# EAGLE design tick-mk-4.3 (EAGLE 6.5.0)
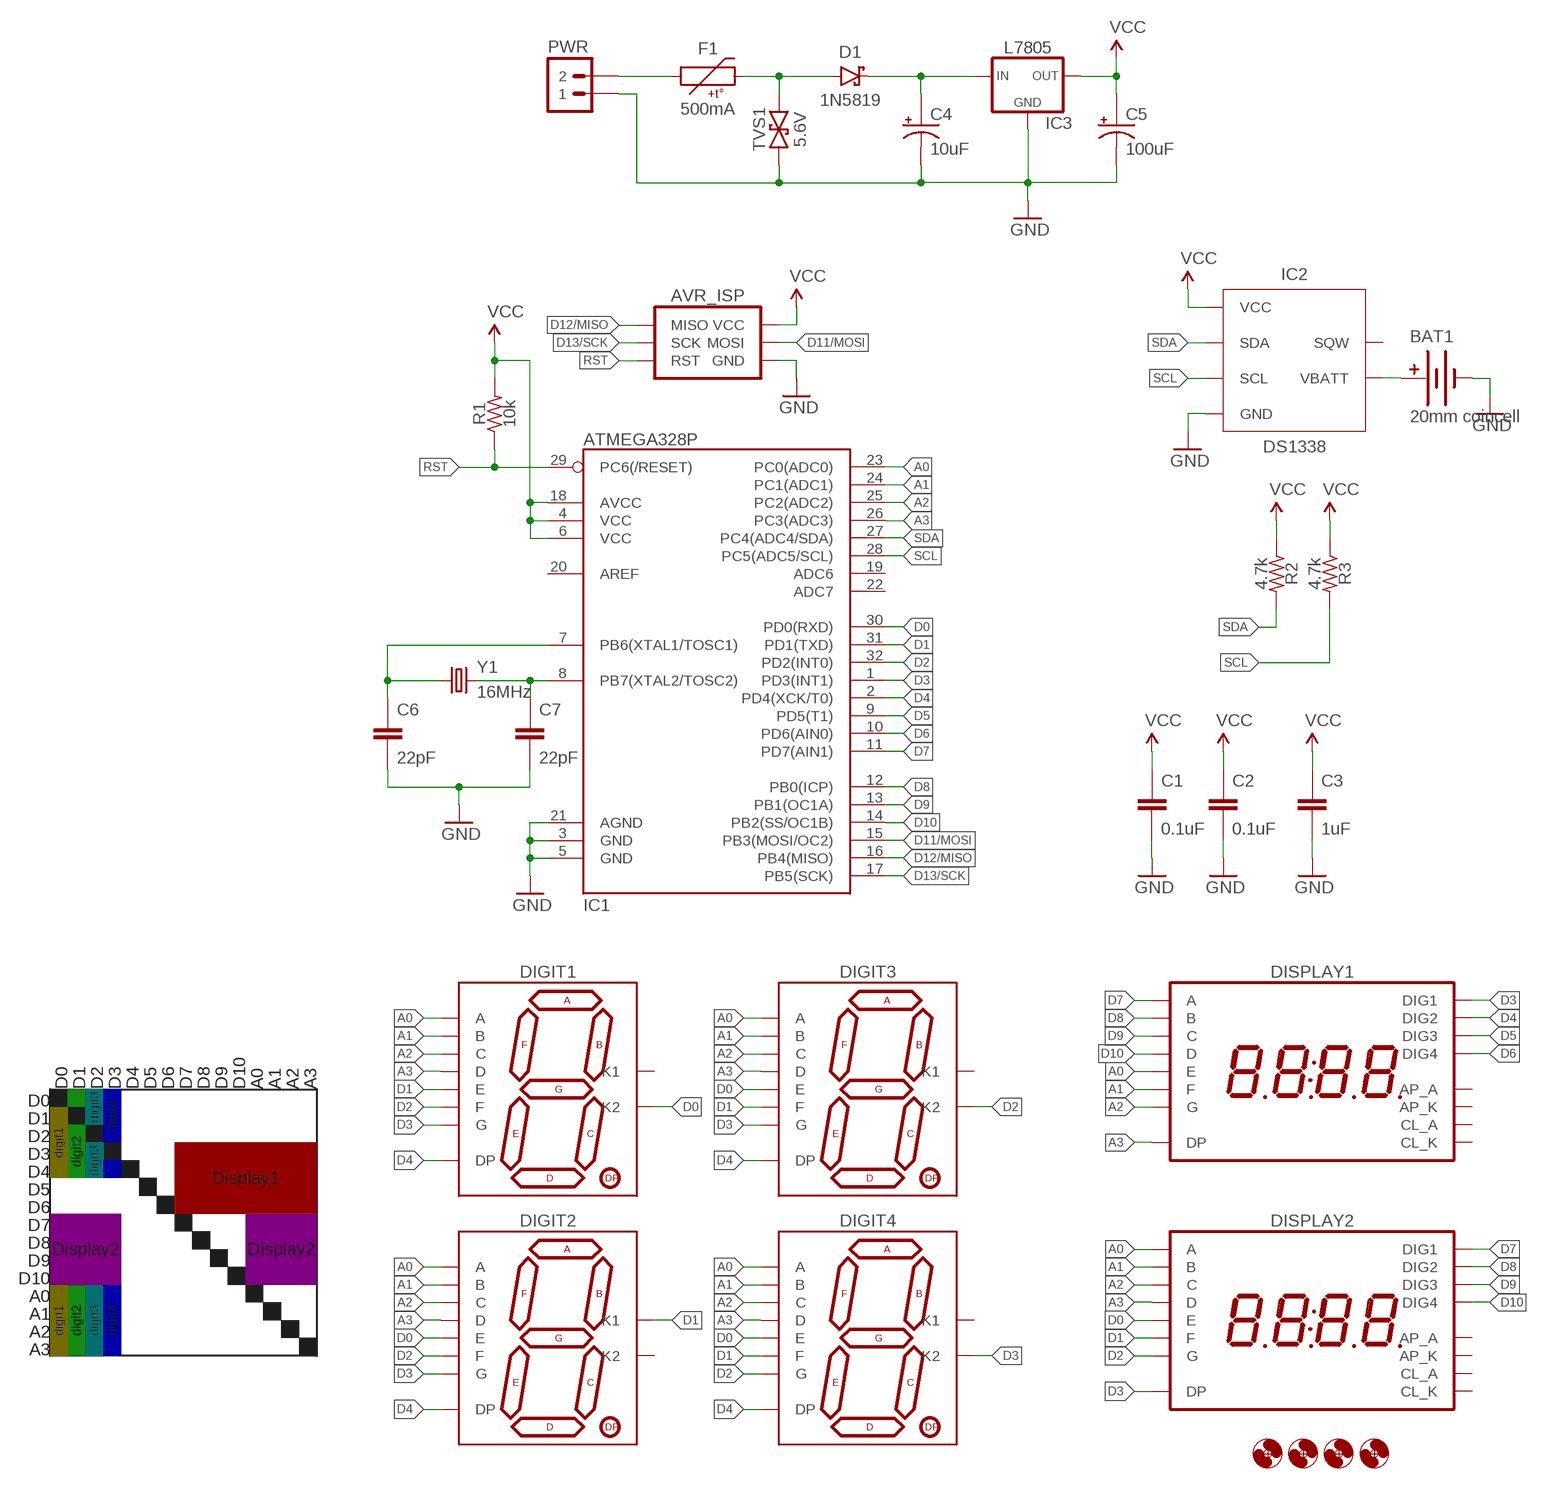
[diagram p0: schematic, sheet 1]

## Parts
AVR_ISP  AVR_SPI_PRG_6PTH  [2X3]
BAT1  20mm coincell  BATTERY20MMSMD-MINE  [BATTCON_20MM_MINE]
C1  0.1uF  CAPACITOR-CERAMIC025-024X044  [C025-024X044]
C2  0.1uF  CAPACITOR-CERAMIC025-024X044  [C025-024X044]
C3  1uF  CAPACITOR-CERAMIC025-024X044  [C025-024X044]
C4  10uF  CAPACITOR-POLARIZEDE2-5  [E2-5]
C5  100uF  CAPACITOR-POLARIZEDE2.5-6  [E2,5-6]
C6  22pF  CAPACITOR-CERAMIC025-024X044  [C025-024X044]
C7  22pF  CAPACITOR-CERAMIC025-024X044  [C025-024X044]
D1  1N5819  DIODE-SCHOTTKYPTH-10.16MM  [DIODE-10.16MM]
DIGIT1  7SEG_1DIGPTH-25.4MM-BARE  [7SEG_1DIG_25.4MM_NOSILK]
DIGIT2  7SEG_1DIGPTH-25.4MM-BARE  [7SEG_1DIG_25.4MM_NOSILK]
DIGIT3  7SEG_1DIGPTH-25.4MM-BARE  [7SEG_1DIG_25.4MM_NOSILK]
DIGIT4  7SEG_1DIGPTH-25.4MM-BARE  [7SEG_1DIG_25.4MM_NOSILK]
DISPLAY1  7SEG_4DIGIT_COLON_APOS  [7SEG_4DIG_10MM]
DISPLAY2  7SEG_4DIGIT_COLON_APOS  [7SEG_4DIG_10MM]
F1  500mA  PTCPTH-5.08MM  [PTC-PTH-5.08MM]
H1  HOLE#2  [HOLE-#2]
H2  HOLE#2  [HOLE-#2]
H3  HOLE#2  [HOLE-#2]
H4  HOLE#2  [HOLE-#2]
IC1  ATMEGA328P  ATMEGA328_SMT  [TQFP32-08]
IC2  DS1338  DS1338CSOIC16W  [SO16W]
IC3  L7805  V_REG_78XXTO-220-THERMPAD  [TO220-IGO-THERMPAD]
PWR  M02JST-PTH-VERT  [JST-2-PH-VERT-PTH]
R1  10k  RESISTORPTH-AXIAL-6.35MM  [RESISTOR-AXIAL-PTH-6.35MM]
R2  4.7k  RESISTORPTH-AXIAL-6.35MM  [RESISTOR-AXIAL-PTH-6.35MM]
R3  4.7k  RESISTORPTH-AXIAL-6.35MM  [RESISTOR-AXIAL-PTH-6.35MM]
TVS1  5.6V  TVSDO-41-10.16MM  [DO-41-TVS-BI-10.16MM]
Y1  16MHz  CRYSTALHC49UV  [HC49U-V]

## Nets
A0: DIGIT1.7(A) DIGIT2.7(A) DIGIT3.7(A) DIGIT4.7(A) DISPLAY1.5(E) DISPLAY2.14(A) IC1.23(PC0(ADC0))
A1: DIGIT1.6(B) DIGIT2.6(B) DIGIT3.6(B) DIGIT4.6(B) DISPLAY1.11(F) DISPLAY2.16(B) IC1.24(PC1(ADC1))
A2: DIGIT1.4(C) DIGIT2.4(C) DIGIT3.4(C) DIGIT4.4(C) DISPLAY1.15(G) DISPLAY2.13(C) IC1.25(PC2(ADC2))
A3: DIGIT1.2(D) DIGIT2.2(D) DIGIT3.2(D) DIGIT4.2(D) DISPLAY1.7(DP) DISPLAY2.3(D) IC1.26(PC3(ADC3))
D0: DIGIT1.8(K2) DIGIT2.1(E) DIGIT3.1(E) DIGIT4.1(E) DISPLAY2.5(E) IC1.30(PD0(RXD))
D1: DIGIT1.1(E) DIGIT2.3(K1) DIGIT3.9(F) DIGIT4.9(F) DISPLAY2.11(F) IC1.31(PD1(TXD))
D2: DIGIT1.9(F) DIGIT2.9(F) DIGIT3.8(K2) DIGIT4.10(G) DISPLAY2.15(G) IC1.32(PD2(INT0))
D3: DIGIT1.10(G) DIGIT2.10(G) DIGIT3.10(G) DIGIT4.8(K2) DISPLAY1.1(DIG1) DISPLAY2.7(DP) IC1.1(PD3(INT1))
D4: DIGIT1.5(DP) DIGIT2.5(DP) DIGIT3.5(DP) DIGIT4.5(DP) DISPLAY1.2(DIG2) IC1.2(PD4(XCK/T0))
D5: DISPLAY1.6(DIG3) IC1.9(PD5(T1))
D6: DISPLAY1.8(DIG4) IC1.10(PD6(AIN0))
D7: DISPLAY1.14(A) DISPLAY2.1(DIG1) IC1.11(PD7(AIN1))
D8: DISPLAY1.16(B) DISPLAY2.2(DIG2) IC1.12(PB0(ICP))
D9: DISPLAY1.13(C) DISPLAY2.6(DIG3) IC1.13(PB1(OC1A))
D10: DISPLAY1.3(D) DISPLAY2.8(DIG4) IC1.14(PB2(SS/OC1B))
D11/MOSI: AVR_ISP.4(MOSI) IC1.15(PB3(MOSI/OC2))
D12/MISO: AVR_ISP.1(MISO) IC1.16(PB4(MISO))
D13/SCK: AVR_ISP.3(SCK) IC1.17(PB5(SCK))
GND: AVR_ISP.6(GND) BAT1.BOTTOM(-) C1.2 C2.2 C3.2 C4.- C5.- C6.2 C7.2 IC1.3(GND) IC1.5(GND) IC1.21(AGND) IC2.4(GND) IC2.5(GND) IC2.6(GND) IC2.7(GND) IC2.8(GND) IC2.9(GND) IC2.10(GND) IC2.11(GND) IC2.12(GND) IC2.13(GND) IC2.15(GND) IC3.4(GND) IC3.GND PWR.1 TVS1.P$1
N$1: BAT1.TOP@1(+) BAT1.TOP@2(+) IC2.14(VBATT)
N$4: D1.A F1.P$2 TVS1.P$2
N$6: C6.1 IC1.7(PB6(XTAL1/TOSC1)) Y1.1
N$7: F1.P$1 PWR.2
N$8: C4.+ D1.C IC3.IN
N$9: C7.1 IC1.8(PB7(XTAL2/TOSC2)) Y1.2
RST: AVR_ISP.5(RST) IC1.29(PC6(/RESET)) R1.P$1
SCL: IC1.28(PC5(ADC5/SCL)) IC2.1(SCL) R3.P$2
SDA: IC1.27(PC4(ADC4/SDA)) IC2.16(SDA) R2.P$2
VCC: AVR_ISP.2(VCC) C1.1 C2.1 C3.1 C5.+ IC1.4(VCC) IC1.6(VCC) IC1.18(AVCC) IC2.3(VCC) IC3.OUT R1.P$2 R2.P$1 R3.P$1
Unconnected: DIGIT1.3(K1) DIGIT2.8(K2) DIGIT3.3(K1) DIGIT4.3(K1) DISPLAY1.4(CL_A) DISPLAY1.9(AP_K) DISPLAY1.10(AP_A) DISPLAY1.12(CL_K) DISPLAY2.4(CL_A) DISPLAY2.9(AP_K) DISPLAY2.10(AP_A) DISPLAY2.12(CL_K) IC1.19(ADC6) IC1.20(AREF) IC1.22(ADC7) IC2.2(SQW)

## Notes on the sheet
- D0 | D1 | D2 | D3 | D4 | D5 | D6 | D7 | D8 | D9 | D10 | A0 | A1 | A2 | A3
- D0 | digit3
- digit4
- D1
- D2 | digit1
- digit2
- D3 | digit3
- D4 | Display1
- D5
- D6
- D7
- D8 | Display2 | Display2
- D9
- D10
- A0
- A1 | digit1 | digit2 | digit3 | digit4
- A2
- A3

## Library data of the parts
AVR_ISP = A_butts:AVR_SPI_PRG_6: AVR ISP 6 Pin This is the reduced ISP connector for AVR programming. Common on Arduino. This footprint will take up less PCB space and can be used with a 10-pin to 6-pin adapter such as SKU: BOB-08508 **Special note about "TEST_POINT" package. The stop mask is on the top side, so if you want your programming test points to be on the bottom of your board, make sure to place this package on the bottom side of the board. This also ensure that the orientation to program from the bottom side will be correct.
BAT1 = A_butts:BATTERY: Battery Holders Various common sizes : AA, AAA, 20mm coin cell and 12mm coin cell. 20MM_4LEGS, BATT-10373
C1-C3 C6 C7 = A_butts:CAPACITOR-CERAMIC: CAPACITOR, European symbol
C4 C5 = A_butts:CAPACITOR-POLARIZED: POLARIZED CAPACITOR, American symbol
D1 = A_butts:DIODE-SCHOTTKY: Schottky diodes in SFE's production catalog BAT20J 1A 23V 0.62Vf RB751 120mA 40V 0.37Vf PMEG4005EJ 0.5A 40V 0.42Vf MBRA140 1A 40V 0.5Vf B340A 3A 40V SMA
DIGIT1-DIGIT4 = A_butts:7SEG_1DIG
DISPLAY1 DISPLAY2 = A_butts:7SEG_4DIGIT_COLON_APOS
F1 = A_butts:PTC: Resettable Fuse PTC Resettable Fuse. Spark Fun Electronics SKU : COM-08357
H1-H4 = A_butts:HOLE: MOUNTING HOLE with drill center marker
IC1 = A_butts:ATMEGA328_SMT: 32-Pin Atmega328 part Commonly used on Arduino compatible boards Available in QFP and QFN packages TQFP is IC-09069 QFN is non-stock; PROD_ID: IC-09069
IC2 = A_butts:DS1338C
IC3 = A_butts:V_REG_78XX: Voltage Regulator Standard 7805 5V regulator. IGO (Input Ground Output). Spark Fun Electronics SKU : COM-00107
PWR = A_butts:M02: Standard 2-pin 0.1" header. Use with - straight break away headers ( PRT-00116) - right angle break away headers (PRT-00553) - swiss pins (PRT-00743) - machine pins (PRT-00117) - female headers (PRT-00115) Molex polarized connector foot print use with: PRT-08233 with associated crimp pins and housings. 2.54_SCREWTERM for use with PRT-10571. 3.5mm Screw Terminal footprints for PRT-08084 5mm Screw Terminal footprints for use with PRT-08433
R1-R3 = A_butts:RESISTOR: RESISTOR, American symbol
TVS1 = A_butts:TVS: Transient voltage suppressor- prevents ESD on inputs. Ignore package description- MBRA140 is NOT this type of part!!!
Y1 = A_butts:CRYSTAL: Various standard crystals. Proven footprints. Spark Fun Electronics SKU : COM-00534

## Board
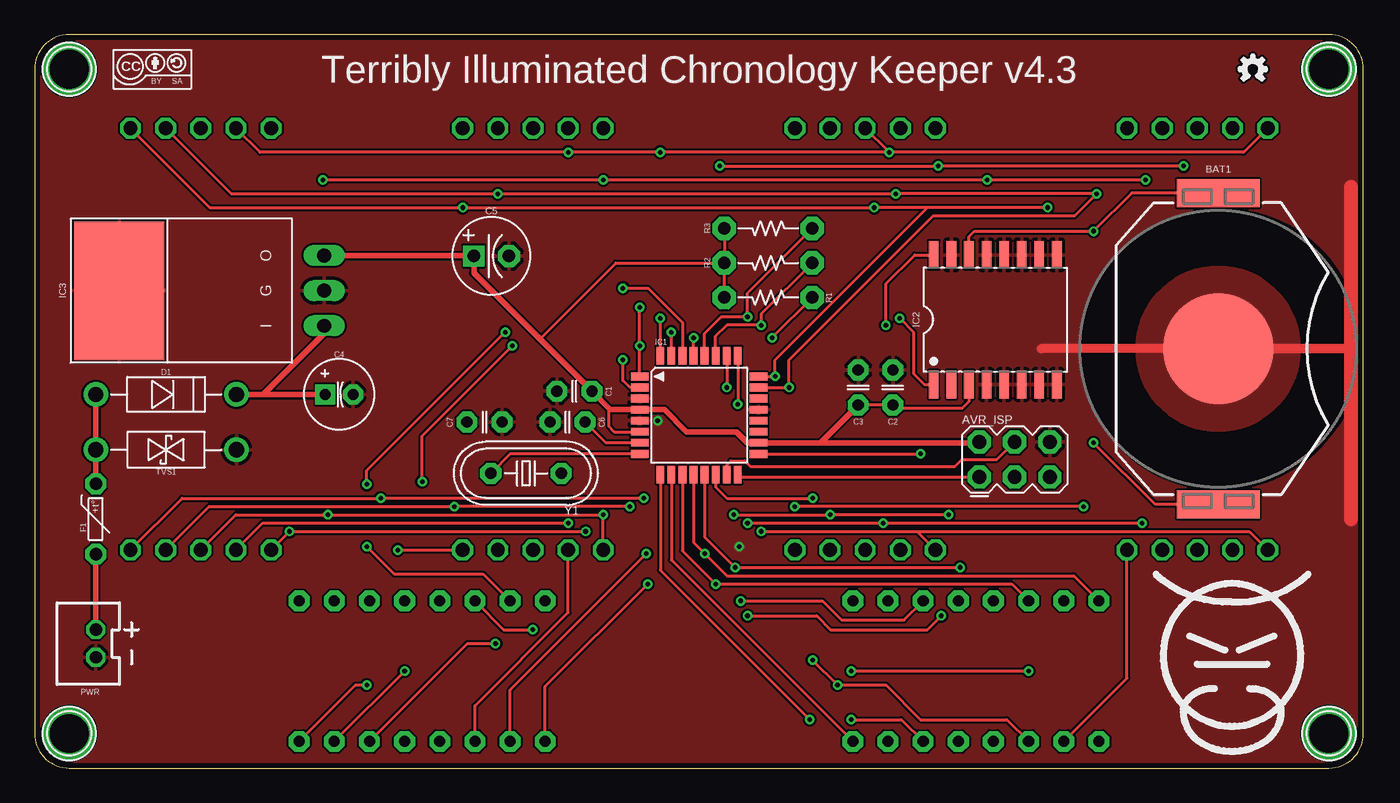
[diagram p1: board, top side]
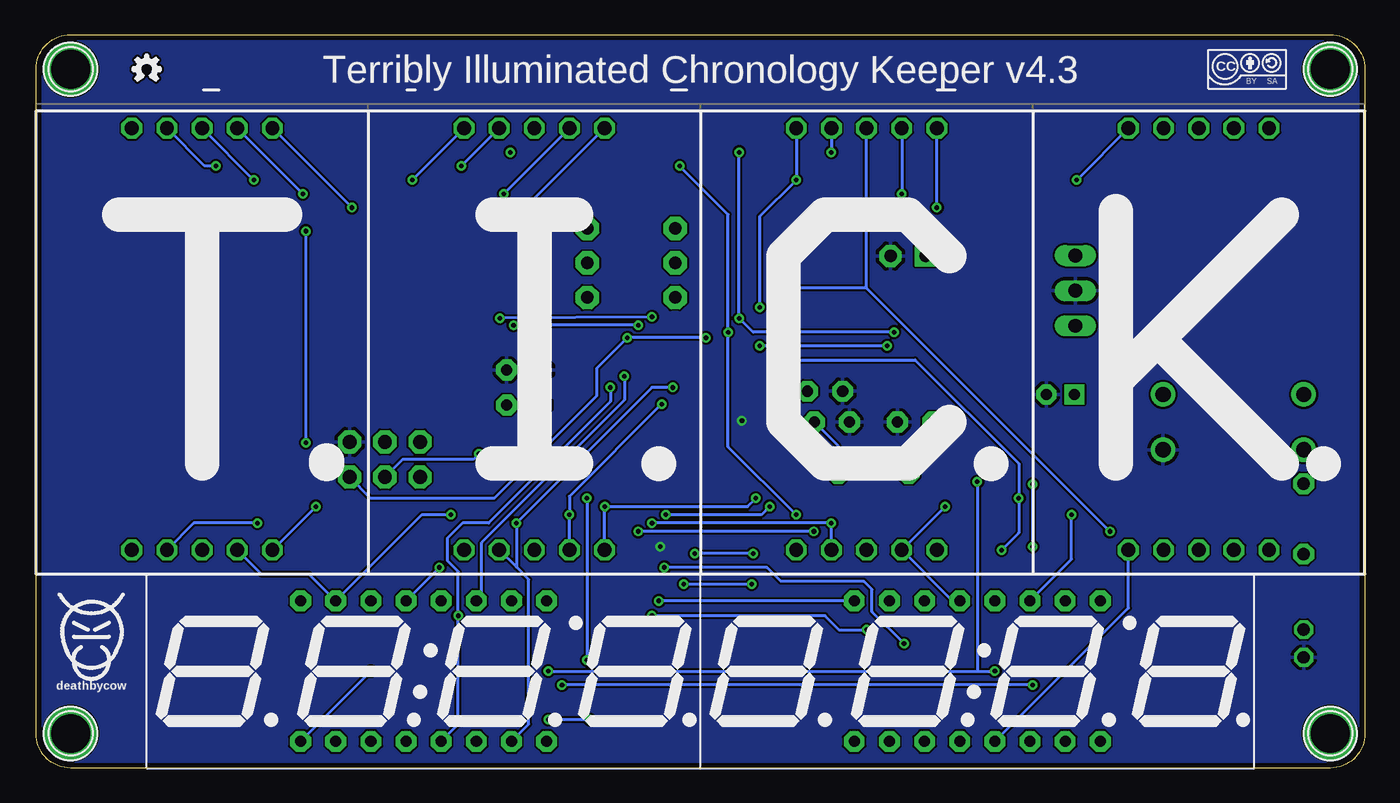
[diagram p2: board, bottom side, seen from below]

Size 96 x 53 mm. Coordinates in mm from the lower left corner, seen from the top.
Outline: 2.5,0 93.5,0 arc90 96,2.5 96,50.5 arc90 93.5,53 2.5,53 arc90 0,50.5 0,2.5 arc90 2.5,0
Copper layers (1*16): Top 0.0356mm / dielectric 1.5011mm / Bottom 0.0356mm
Design rules "LaenPCBOrder2": minimum track width 6mil, minimum drill 13mil, track to track 6mil, track to pad 6mil, pad to pad 6mil, via to via 6mil, smd to smd 6mil, copper to edge 15mil, drill to drill 6mil, minimum pad ring 7mil, minimum via ring 7mil, stop-mask expansion 3mil, vias tented up to drill 20mil, thermal gap 10mil

### Footprints (pad centres in the part's own frame; a part is rotated, then mirrored left to right if it is on the bottom)
2X3 = drill 1 pad 1.676 octagon: 1 -2.54,-1.27; 2 -2.54,1.27; 3 0,-1.27; 4 0,1.27; 5 2.54,-1.27; 6 2.54,1.27
BATTCON_20MM_MINE = smd 8 x 8: BOTTOM 0,0 | smd 6 x 2: TOP@1 0,11.25; TOP@2 0,-11.25
C025-024X044 = drill 0.813 pad 1.5 octagon: 1 -1.27,0; 2 1.27,0
E2-5 = drill 0.813 pad 1.422 square: + -1.016,0 | drill 0.813 pad 1.422 octagon: - 1.016,0
E2,5-6 = drill 0.9 pad 1.524 square: + -1.27,0 | drill 0.9 pad 1.6 octagon: - 1.27,0
DIODE-10.16MM = drill 1.1 pad 1.778: A -5.08,0; C 5.08,0
7SEG_1DIG_25.4MM_NOSILK = drill 1 pad 1.5 octagon: 1 -5.08,-15.24; 2 -2.54,-15.24; 3 0,-15.24; 4 2.54,-15.24; 5 5.08,-15.24; 6 5.08,15.24; 7 2.54,15.24; 8 0,15.24; 9 -2.54,15.24; 10 -5.08,15.24
7SEG_4DIG_10MM = drill 0.8 pad 1.5 octagon: 1 -8.89,-5.08; 2 -6.35,-5.08; 3 -3.81,-5.08; 4 -1.27,-5.08; 5 1.27,-5.08; 6 3.81,-5.08; 7 6.35,-5.08; 8 8.89,-5.08; 9 8.89,5.08; 10 6.35,5.08; 11 3.81,5.08; 12 1.27,5.08; 13 -1.27,5.08; 14 -3.81,5.08; 15 -6.35,5.08; 16 -8.89,5.08
PTC-PTH-5.08MM = drill 0.9 pad 1.5 octagon: P$1 -2.54,0; P$2 2.54,0
HOLE-#2 = drill 2.8 pad 3.81: P$1 0,0
TQFP32-08 = smd 1.27 x 0.559: 1 -4.293,2.8; 2 -4.293,2; 3 -4.293,1.2; 4 -4.293,0.4; 5 -4.293,-0.4; 6 -4.293,-1.2; 7 -4.293,-2; 8 -4.293,-2.8; 17 4.293,-2.8; 18 4.293,-2; 19 4.293,-1.2; 20 4.293,-0.4; 21 4.293,0.4; 22 4.293,1.2; 23 4.293,2; 24 4.293,2.8 | smd 0.559 x 1.27: 9 -2.8,-4.293; 10 -2,-4.293; 11 -1.2,-4.293; 12 -0.4,-4.293; 13 0.4,-4.293; 14 1.2,-4.293; 15 2,-4.293; 16 2.8,-4.293; 25 2.8,4.293; 26 2,4.293; 27 1.2,4.293; 28 0.4,4.293; 29 -0.4,4.293; 30 -1.2,4.293; 31 -2,4.293; 32 -2.8,4.293
SO16W = smd 0.7 x 2: 1 -4.445,-4.685; 2 -3.175,-4.685; 3 -1.905,-4.685; 4 -0.635,-4.685; 5 0.635,-4.685; 6 1.905,-4.685; 7 3.175,-4.685; 8 4.445,-4.685; 9 4.445,4.685; 10 3.175,4.685; 11 1.905,4.685; 12 0.635,4.685; 13 -0.635,4.685; 14 -1.905,4.685; 15 -3.175,4.685; 16 -4.445,4.685
TO220-IGO-THERMPAD = smd 10 x 6.5: 4 0,11 | drill 1 long: GND 0,-3.81; IN -2.54,-3.81; OUT 2.54,-3.81
JST-2-PH-VERT-PTH = drill 0.9 octagon: 1 -1,0; 2 1,0
RESISTOR-AXIAL-PTH-6.35MM = drill 0.9 pad 1.676 octagon: P$1 -3.175,0; P$2 3.175,0
DO-41-TVS-BI-10.16MM = drill 1.1 pad 1.778: P$1 -5.08,0; P$2 5.08,0
HC49U-V = drill 0.813 pad 1.524 octagon: 1 -2.54,0; 2 2.54,0

### Placement (x,y rotation side)
AVR_ISP  70.8,22.3 0 top
BAT1  85.5,30.3 0 top
C1  39,27.23 180 top
C2  62,27.5 90 top
C3  59.5,27.5 90 top
C4  22,27 0 top
C5  33,37 0 top
C6  38.5,25 180 top
C7  32.5,25 0 top
D1  9.5,27 0 top
DIGIT1  36,31 0 bottom
DIGIT2  12,31 0 bottom
DIGIT3  60,31 0 bottom
DIGIT4  84,31 0 bottom
DISPLAY1  68,7 0 bottom
DISPLAY2  28,7 0 bottom
F1  4.42,18 90 top
H1  2.5,2.5 0 top
H2  2.5,50.5 0 top
H3  93.5,2.5 0 top
H4  93.5,50.5 0 top
IC1  48,25.5 0 top
IC2  69.4,32.4 0 top
IC3  17.1,34.5 90 top
PWR  4.42,9 90 top
R1  53,34 180 top
R2  53,36.5 0 top
R3  53,39 0 top
TVS1  9.5,23 180 top
U$1  [CC-BY-SA-4.0-NO-URL]  8.5,50.5 0 top
U$2  [CC-BY-SA-4.0-NO-URL]  8.5,50.5 0 bottom
U$3  [COW]  86.5,7 0 top
U$4  [COW_SMALL]  92,10 0 bottom
U$6  [OSHWLOGO_MINI]  88,50.5 0 bottom
U$7  [OSHWLOGO_MINI]  88,50.5 0 top
Y1  35.5,21.3 180 top

### Tracks (layer width: path | path; a pad name or v marks a point on that pad's centre or on a via)
A0  (via drill 0.33)
  Top 0.2: DIGIT2.7 14.2,41.5 v33.46,41.5 v62.2,41.5 v76.72,41.5 75.12,39.9 64.9,39.9 54.5,29.5 v54.5,27.5 IC1.23 | DISPLAY2.14 33.89,10 v36,10 | v51.5,11 56.5,11 57.5,10 64.5,10 v65.5,11
  Bottom 0.2: DIGIT4.7 v76.72,41.5 | v62.2,41.5 DIGIT3.7 | DIGIT1.7 v33.46,41.5 | DISPLAY1.5 65.5,3.15 v65.5,11 65.5,14.2 66.3,15 66.3,16.6 65.2,17.7 63.3,17.7 54.5,26.5 v54.5,27.5 | v51.5,11 39,11 38,10 v36,10
A1  (via drill 0.33)
  Top 0.2: IC1.24 v53.5,28.3 53.5,29.5 64.5,40.5 | v73.18,40.5 64.5,40.5 | 64.5,40.5 v60.66,40.5 v30.92,40.5 12.66,40.5 DIGIT2.6 | v51,12.08 56.92,12.08 58.3,10.7 62.81,10.7 DISPLAY1.11
  Bottom 0.2: DIGIT4.6 v73.18,40.5 | v60.66,40.5 DIGIT3.6 | v30.92,40.5 DIGIT1.6 | DISPLAY1.11 63.8,12.47 63.8,16.3 53.5,26.6 v53.5,28.3 | DISPLAY2.16 v51,12.08
A2  (via drill 0.33)
  Top 0.2: DIGIT2.4 12.6,18.9 v30.32,18.9 v43,18.9 | v66.03,18.3 v57.46,18.3 v50.5,18.3 | IC1.25 v50.8,26.3
  Bottom 0.2: DIGIT3.4 v57.46,18.3 57.46,19.64 v50.8,26.3 | v43,18.9 43.6,18.3 v50.5,18.3 | DISPLAY2.13 29.78,12.08 DIGIT1.4 v30.32,18.9 | DIGIT4.4 79.7,14 76.27,14 DISPLAY1.15 68.13,18.3 v66.03,18.3
A3  (via drill 0.33)
  Top 0.2: v38.54,17.7 16.48,17.7 DIGIT2.2 | v51.5,17.7 v61.3,17.7 v80,17.7 | IC1.26 v50,27.5 | DISPLAY2.3 31.81,4.51 38.54,11.24 DIGIT1.2
  Bottom 0.2: v51.5,17.7 v38.54,17.7 DIGIT1.2 | DISPLAY1.7 60.4,3.17 60.4,13.62 61.3,14.52 | v50,27.5 51.5,27.5 v61.3,17.7 61.3,14.52 | 61.3,14.52 DIGIT3.2 | v80,17.7 84.6,17.7 DIGIT4.2
D0  (via drill 0.33)
  Top 0.2: IC1.30 46.8,32.2 44.32,34.68 v42.5,34.68 | v39.8,17.1 v18.42,17.1 DIGIT2.1 | v52.5,17.1 63.8,17.1 | 63.8,17.1 87.74,17.1 DIGIT4.1 | DIGIT3.1 63.8,17.04 63.8,17.1
  Bottom 0.2: v39.8,17.1 v52.5,17.1 | v18.42,17.1 36,34.68 | DISPLAY2.5 17.08,11.57 DIGIT2.1 | 36,34.68 DIGIT1.8 | 36,34.68 v42.5,34.68
D1  (via drill 0.33)
  Top 0.2: v83,43.5 v65.28,43.5 v49.5,43.5 | IC1.31 v46,31.5 | DIGIT2.3 14.54,18.3 v21.19,18.3 v41.08,18.3 DIGIT1.1
  Bottom 0.2: v65.28,43.5 DIGIT3.9 | v49.5,43.5 46,40 v46,31.5 46,23.22 v41.08,18.3 | DISPLAY2.11 21.19,15.08 v21.19,18.3 | v83,43.5 83.8,43.5 DIGIT4.9
D2  (via drill 0.33)
  Top 0.2: IC1.32 v45.2,32.5 | DIGIT2.9 16.28,44.5 v38.54,44.5 v45.2,44.5 v61.74,44.5 | DIGIT4.10 87.34,44.5 v61.74,44.5 | v61.74,44.5 DIGIT3.8 | DISPLAY2.15 32.43,14 26,14 v24,16 | v24,20.5 24,21.5 v34,31.5
  Bottom 0.2: DIGIT1.9 v38.54,44.5 | v45.2,44.5 v45.2,32.5 44.2,31.5 v34,31.5 | v24,16 v24,20.5
D3  (via drill 0.33)
  Top 0.2: v80.26,42.5 v68.82,42.5 v41.08,42.5 v20.82,42.5 | IC1.1 v43.71,30.5 v43.71,33.29 | v71.81,7 v59,7 | v26.73,7 DISPLAY2.7 | v28,20.7 28,24 v34.5,30.5
  Bottom 0.2: DIGIT2.10 v20.82,42.5 | DIGIT4.8 v80.26,42.5 | v68.82,42.5 DIGIT3.10 | DIGIT1.10 v41.08,42.5 | 41.1,42.48 v41.08,42.5 | DISPLAY1.1 v71.81,7 | v59,7 28,7 | 28,7 v26.73,7 | v34.5,30.5 v43.71,30.5 | v28,20.7 28,7 | v43.71,33.29 43.71,39.87 v41.08,42.5
D4  (via drill 0.33)
  Top 0.2: DIGIT2.5 10.66,19.5 v25,19.5 v44,19.5 | v75.78,18.9 v54.92,18.9 | DISPLAY1.2 78.92,6.49 DIGIT4.5 | IC1.2 43,27.5 42.5,28 v42.5,29.5 | v26.24,15.76 DIGIT1.5
  Bottom 0.2: v44,19.5 44.6,18.9 v54.92,18.9 DIGIT3.5 | v42.5,29.5 32.5,29.5 25,22 v25,19.5 25,17 v26.24,15.76 | v75.78,18.9 DIGIT4.5
D5  (via drill 0.33)
  Top 0.2: IC1.9 45.2,14.3 v56,3.5 | v59,3.5 62.61,3.5 DISPLAY1.6
  Bottom 0.2: v56,3.5 v59,3.5
D6
  Top 0.2: IC1.10 46,15.03 DISPLAY1.8
D7  (via drill 0.33)
  Top 0.2: DISPLAY1.14 70.59,13.3 v49.2,13.3 46.8,15.7 IC1.11 | DISPLAY2.1 36.89,5.89 v44.3,13.3
  Bottom 0.2: v49.2,13.3 v44.3,13.3
D8  (via drill 0.33)
  Top 0.2: DISPLAY1.16 75.07,13.9 50,13.9 v48.4,15.5 47.6,16.3 IC1.12 | DISPLAY2.2 34.35,5.65 v44.2,15.5
  Bottom 0.2: v44.2,15.5 v48.4,15.5
D9  (via drill 0.33)
  Top 0.2: IC1.13 48.4,16.7 v50.6,14.5 v66.85,14.5 | DISPLAY2.6 31.27,9 v33.3,9
  Bottom 0.2: v33.3,9 35.6,11.3 35.6,12.9 36.2,13.5 42.2,13.5 43.2,14.5 v50.6,14.5 | v66.85,14.5 DISPLAY1.13
D10  (via drill 0.33)
  Top 0.2: IC1.14 49.2,20.3 50,19.5 v56.2,19.5 | DISPLAY1.3 70.23,3.5 64,3.5 61.5,6 v58,6 v56.2,7.8 | DISPLAY2.8 23.19,6 v23.99,6
  Bottom 0.2: v23.99,6 v58,6 | v56.2,19.5 v56.2,7.8
D11/MOSI
  Top 0.2: IC1.15 50,21.9 50.3,22.2 51.3,22.2 51.7,21.8 66.5,21.8 67,22.3 69.53,22.3 AVR_ISP.4
D12/MISO
  Top 0.2: IC1.16 50.98,21.03 AVR_ISP.1
D13/SCK  (via drill 0.33)
  Top 0.2: IC1.17 v64,22.7
  Bottom 0.2: v64,22.7 64.4,22.3 69.5,22.3 70.77,21.03 AVR_ISP.3
GND  (via drill 0.33)
  Top 0.66: BAT1.BOTTOM 72.7,30.3
  Top 0.67: BAT1.BOTTOM 95,30.3
  Top 1: 95.1,18 95.1,42
  other vias: 45,25.1 50.9,16
  pour Bottom: 2.5,53 93.5,53 arc-90 96,50.5 96,2.5 arc-90 93.5,0 2.5,0 arc-90 0,2.5 0,50.5 arc-90
  pour Top: 2.5,53 93.5,53 arc-90 96,50.5 96,30.75 arc90 85.5,40.5 arc90 75.5,30.5 75.5,30 arc90 85.5,20 arc90 96,30.25 96,2.5 arc-90 93.5,0 2.5,0 arc-90 0,2.5 0,50.5 arc-90
  pour Top (no thermals): 91.4,30.3 arc90 85.5,36.2 arc90 79.6,30.3 arc90 85.5,24.4 arc90
N$1  (via drill 0.33)
  Top 0.2: BAT1.TOP@2 80.95,19.05 v76.5,23.5 | IC2.14 67.5,38.4 67.9,38.8 v76.5,38.8 79.25,41.55 BAT1.TOP@1
  Bottom 0.2: v76.5,23.5 v76.5,38.8
N$4
  Top 0.4: D1.A TVS1.P$2 F1.P$2
N$6
  Top 0.2: IC1.7 41.27,23.5 C6.1
  Bottom 0.2: Y1.1 38.04,23.27 C6.1
N$7
  Top 0.4: PWR.2 F1.P$1
N$8
  Top 0.4: D1.C 16.5,27 | 16.5,27 C4.+ | IC3.IN 20.91,31.41 16.5,27
N$9
  Top 0.2: IC1.8 34.36,22.7 Y1.2
  Bottom 0.2: C7.1 32.96,23.27 Y1.2
RST  (via drill 0.33)
  Top 0.2: IC1.29 v47.6,31.1 | R1.P$1 v53.27,31.1
  Bottom 0.2: v47.6,31.1 v53.27,31.1 55.5,28.88 55.5,26.9 62.9,19.5 71.81,19.5 AVR_ISP.5
SCL  (via drill 0.33)
  Top 0.2: IC1.28 48.4,31.4 49.6,32.6 v51.5,32.6 51.5,34.33 R3.P$2 | v62.5,32.5 63.5,31.5 63.5,28.5 64.28,27.71 IC2.1
  Bottom 0.2: v51.5,32.6 v62.5,32.5
SDA  (via drill 0.33)
  Top 0.2: IC1.27 49.2,31.2 50,32 v52.5,32 52.5,32.83 R2.P$2 | v61.5,32 61.5,35 63.59,37.09 IC2.16
  Bottom 0.2: v52.5,32 v61.5,32
VCC
  Top 0.152: 51.5,23.5 IC1.18
  Top 0.2: IC1.6 41.87,24.3 41.5,24.67 41.5,26 | 36.5,31 42,36.5 R2.P$1 | R1.P$2 R2.P$1 | R3.P$1 R2.P$1 | C3.1 C2.1 62.23,26 67,26 67.5,26.5 IC2.3
  Top 0.4: 51.5,23.5 50.7,24.3 47.1,24.3 45.5,25.9 IC1.4 41.6,25.9 41.5,26 C1.1 36.5,31 31.73,35.77 C5.+ 31.69,37.04 IC3.OUT | IC1.18 56.77,23.5 | 56.77,23.5 C3.1 | AVR_ISP.2 68.19,23.5 56.77,23.5

### Text on the board
tPlace: Terribly Illuminated Chronology Keeper v4.3
bPlace: Terribly Illuminated Chronology Keeper v4.3